# EAGLE design ir-control (EAGLE 7.6.0)
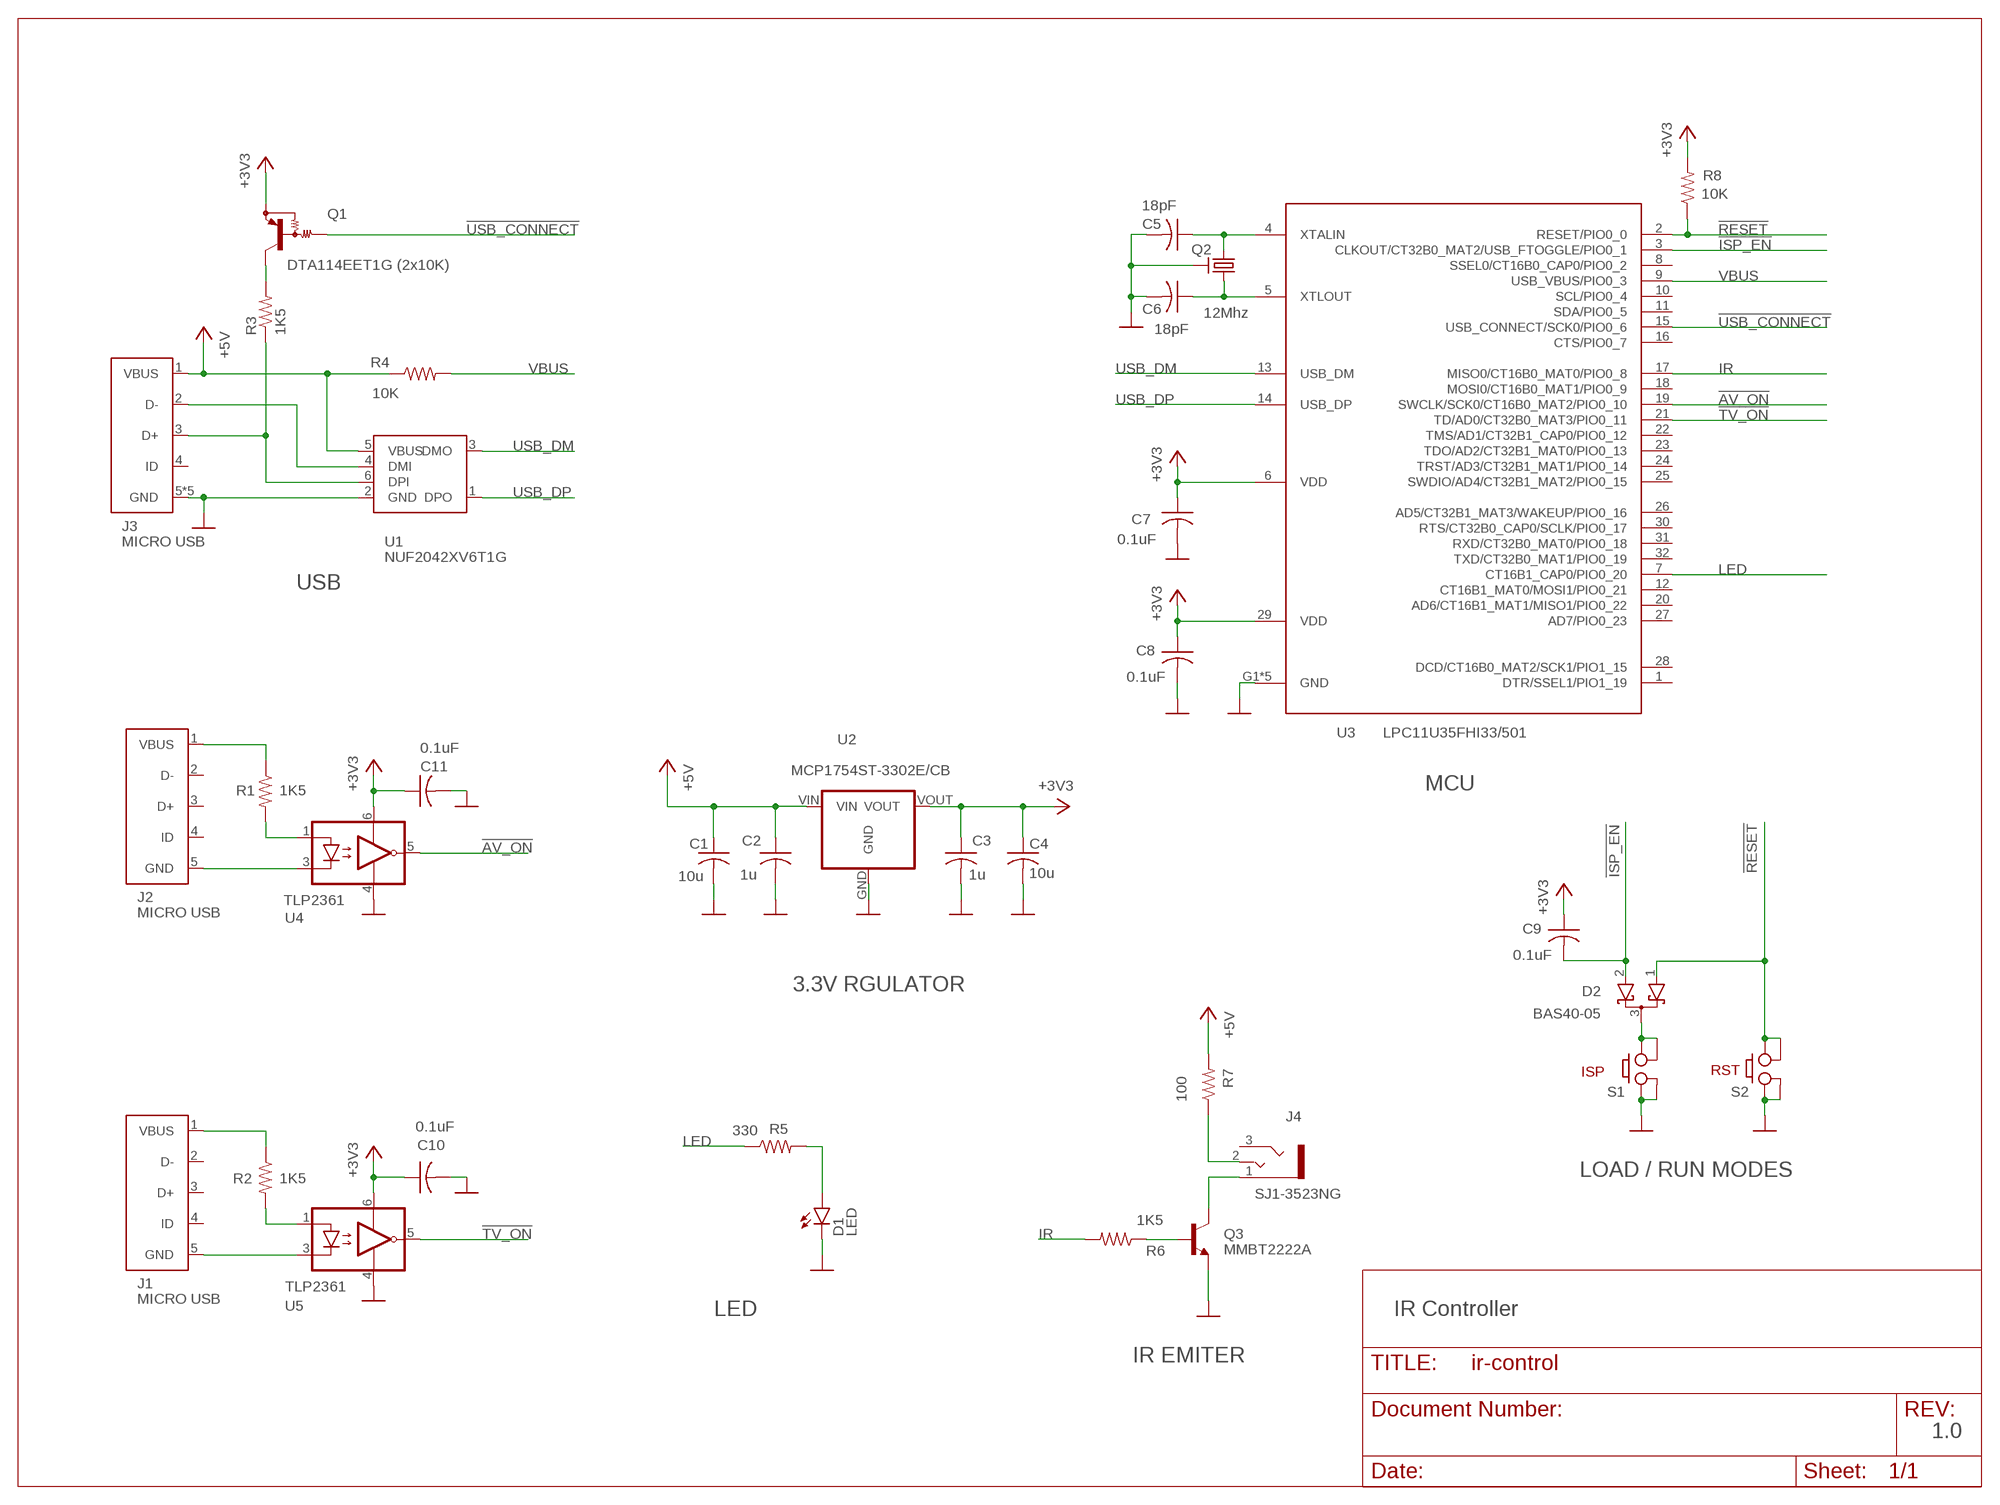
[diagram p0: schematic, sheet 1]

## Parts
C1  10u  CC0805K  [C0805K]
C2  1u  CC0603K  [C0603K]
C3  1u  CC0603K  [C0603K]
C4  10u  CC0805K  [C0805K]
C5  18pF  CC0402K  [C0402K]
C6  18pF  CC0402K  [C0402K]
C7  0.1uF  CC0402K  [C0402K]
C8  0.1uF  CC0402K  [C0402K]
C9  0.1uF  CC0402K  [C0402K]
C10  0.1uF  CC0402K  [C0402K]
C11  0.1uF  CC0402K  [C0402K]
D1  LED  [LED]
D2  BAS40-05  [SOT23]
J1  MICRO USB  USB-CONN-UNSHIELDED  [USB-MICRO]
J2  MICRO USB  USB-CONN-UNSHIELDED  [USB-MICRO]
J3  MICRO USB  USB-CONN  [USB-MICRO]
J4  SJ1-3523NG  JACKX  [JACK]
Q1  DTA114EET1G (2x10K)  PNP-BIASED  [SC75-BEC]
Q2  12Mhz  CRYSTALCTS406  [CRYSTAL]
Q3  MMBT2222A  NPN  [SOT23]
R1  1K5  RR0402  [R0402]
R2  1K5  RR0402  [R0402]
R3  1K5  RR0402  [R0402]
R4  10K  RR0402  [R0402]
R5  330  RR0402  [R0402]
R6  1K5  RR0402  [R0402]
R7  100  RR0402  [R0402]
R8  10K  RR0402  [R0402]
S1  CKN10502CT-ND  PUSH-BUTTON  [PUSH_BUTTON]
S2  PUSH-BUTTON  [PUSH_BUTTON]
U1  NUF2042XV6T1G  USB-ESD  [SOT-563]
U2  MCP1754ST-3302E/CB  LDO  [SOT-23A]
U3  LPC11U35FHI33/501  LPC11U35FHN33/501  [HVQFN33-5MM]
U4  TLP2361  OPTO_COUPLER  [SO6]
U5  TLP2361  OPTO_COUPLER  [SO6]

## Nets
!AV_ON: U3.19(SWCLK/SCK0/CT16B0_MAT2/PIO0_10) U4.5(OUT)
!ISP_EN: C9.2 D2.2(A2) U3.3(CLKOUT/CT32B0_MAT2/USB_FTOGGLE/PIO0_1)
!RESET: D2.1(A1) R8.1 S2.B1 S2.B1P(B1) S2.B2 S2.B2P(B2) U3.2(RESET/PIO0_0)
!TV_ON: U3.21(TD/AD0/CT32B0_MAT3/PIO0_11) U5.5(OUT)
!USB_CONNECT: Q1.B U3.15(USB_CONNECT/SCK0/PIO0_6)
+3V3: C3.1 C4.1 C7.1 C8.1 C9.1 C10.1 C11.1 Q1.E R8.2 U2.VOUT U3.6(VDD) U3.29(VDD) U4.6(VCC) U5.6(VCC)
+5V: C1.1 C2.1 J3.1(VBUS) R4.1 R7.2 U1.5(VBUS) U2.VIN
GND: C1.2 C2.2 C3.2 C4.2 C5.2 C6.2 C7.2 C8.2 C10.2 C11.2 D1.K(C) J3.5(GND) J3.G1(GND) J3.G2(GND) J3.G3(GND) J3.G4(GND) Q2.2(GND) Q2.4(GND) Q3.2(E) S1.A1 S1.A1P(A1) S1.A2 S1.A2P(A2) S2.A1 S2.A1P(A1) S2.A2 S2.A2P(A2) U1.2(GND) U2.GND U3.G1(GND) U3.G2(GND) U3.G3(GND) U3.G4(GND) U3.TAB(GND) U4.4(GND) U5.4(GND)
IR: R6.2 U3.17(MISO0/CT16B0_MAT0/PIO0_8)
LED: R5.1 U3.7(CT16B1_CAP0/PIO0_20)
N$1: C5.1 Q2.3 U3.4(XTALIN)
N$2: J2.1(VBUS) R1.1
N$3: C6.1 Q2.1 U3.5(XTLOUT)
N$4: Q3.1(B) R6.1
N$5: Q1.C R3.2
N$6: J3.3(D+) R3.1 U1.6(DPI)
N$7: J1.1(VBUS) R2.1
N$8: J4.1 Q3.3(C)
N$9: J4.2 R7.1
N$10: J2.5(GND) U4.3(C)
N$11: J1.5(GND) U5.3(C)
N$12 [critical]: J3.2(D-) U1.4(DMI)
N$13: R2.2 U5.1(A)
N$14: D1.A R5.2
N$15: R1.2 U4.1(A)
N$16: D2.3(C) S1.B1 S1.B1P(B1) S1.B2 S1.B2P(B2)
USB_DM [critical]: U1.3(DMO) U3.13(USB_DM)
USB_DP [critical]: U1.1(DPO) U3.14(USB_DP)
VBUS: R4.2 U3.9(USB_VBUS/PIO0_3)
Unconnected: J1.2(D-) J1.3(D+) J1.4(ID) J2.2(D-) J2.3(D+) J2.4(ID) J3.4(ID) J4.3 U3.1(DTR/SSEL1/PIO1_19) U3.8(SSEL0/CT16B0_CAP0/PIO0_2) U3.10(SCL/PIO0_4) U3.11(SDA/PIO0_5) U3.12(CT16B1_MAT0/MOSI1/PIO0_21) U3.16(CTS/PIO0_7) U3.18(MOSI0/CT16B0_MAT1/PIO0_9) U3.20(AD6/CT16B1_MAT1/MISO1/PIO0_22) U3.22(TMS/AD1/CT32B1_CAP0/PIO0_12) U3.23(TDO/AD2/CT32B1_MAT0/PIO0_13) U3.24(TRST/AD3/CT32B1_MAT1/PIO0_14) U3.25(SWDIO/AD4/CT32B1_MAT2/PIO0_15) U3.26(AD5/CT32B1_MAT3/WAKEUP/PIO0_16) U3.27(AD7/PIO0_23) U3.28(DCD/CT16B0_MAT2/SCK1/PIO1_15) U3.30(RTS/CT32B0_CAP0/SCLK/PIO0_17) U3.31(RXD/CT32B0_MAT0/PIO0_18) U3.32(TXD/CT32B0_MAT1/PIO0_19)

## Notes on the sheet
- USB
- MCU
- 3.3V RGULATOR
- ISP | RST
- LOAD / RUN MODES
- LED | IR Controller
- IR EMITER
- 1.0

## Library data of the parts
C1-C11 = ir-control:C
D1 = ir-control:LED
D2 = ir-control:BAS40-05
J1 J2 = ir-control:USB-CONN-UNSHIELDED
J3 = ir-control:USB-CONN
J4 = ir-control:JACK: Jack connectors according to JISC 6560, 2.5mm / 3.5 mm Klinkensteckverbinder nach JISC 6560, 2.5mm / 3,5 mm Source: http://www.lumberg.com/Produkte/PDFs/KLBR2.pdf www.lumberg.com/Produkte/PDFs/KLBR1.pdf; MPN: KLBR 1; OC_FARNELL: 1200140; OC_NEWARK: 97K2707
Q1 = ir-control:PNP-BIASED: DTA114EET1G (Digikey DTA114EET1GOSCT-ND)
Q2 = ir-control:CRYSTAL: CRYSTAL; OC_FARNELL: unknown; OC_NEWARK: unknown
Q3 = ir-control:NPN: NPN Transistor
R1-R8 = ir-control:R: RESISTOR, American symbol
S1 S2 = ir-control:PUSH-BUTTON: CKN10502CT-ND
U1 = ir-control:USB-ESD
U2 = ir-control:LDO
U3 = ir-control:LPC11U35FHN33/501
U4 U5 = ir-control:OPTO_COUPLER

## Net classes
0 default: clearance 0.205 mm
1 power: width 0.254 mm
2 critical: clearance 0.205 mm to class 0, clearance 0.205 mm to class 1, clearance 0.205 mm

## Board
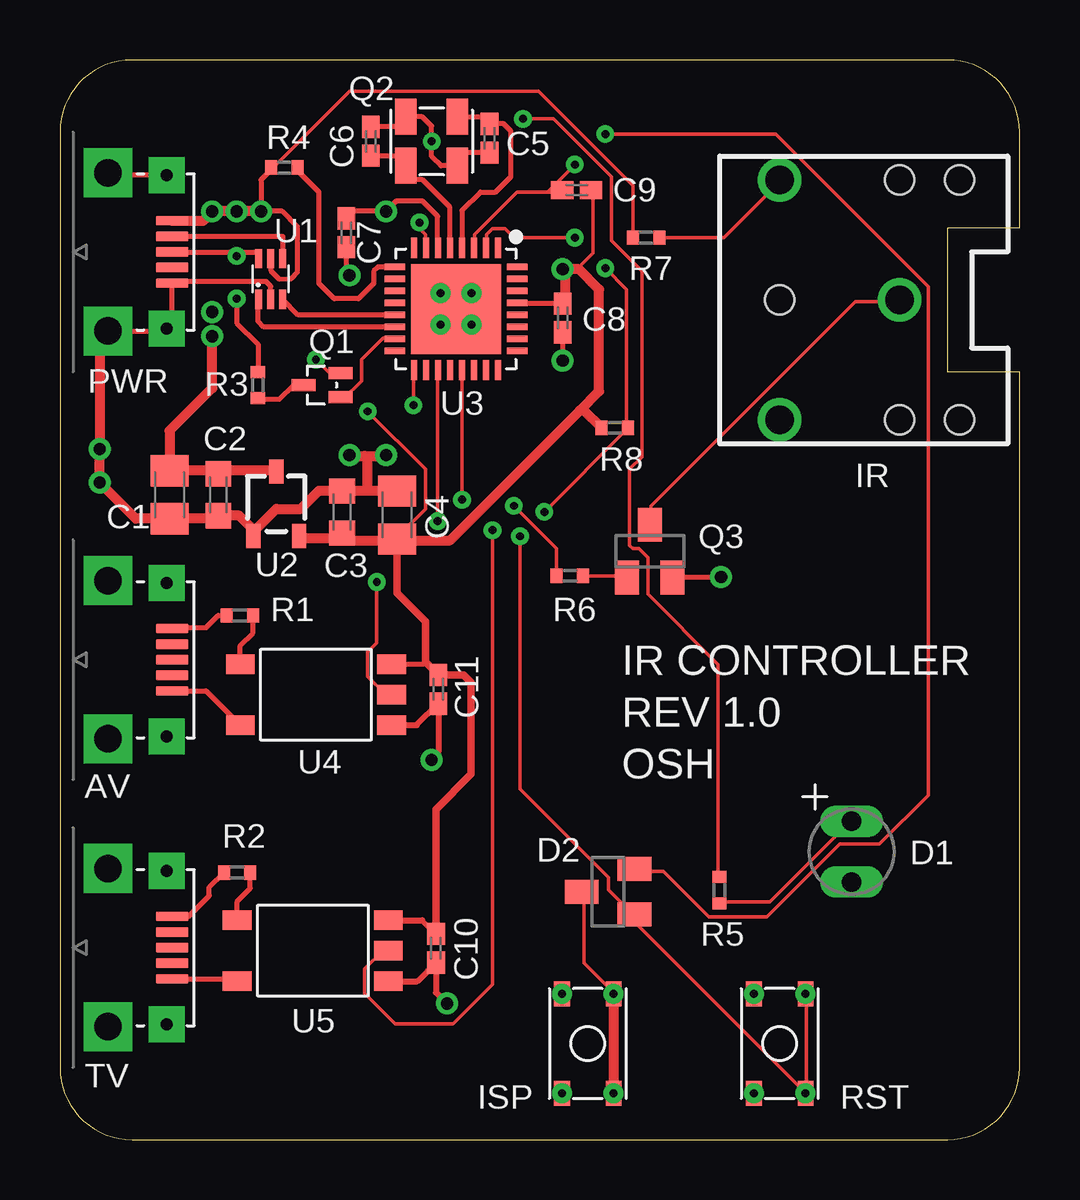
[diagram p1: board, top side]
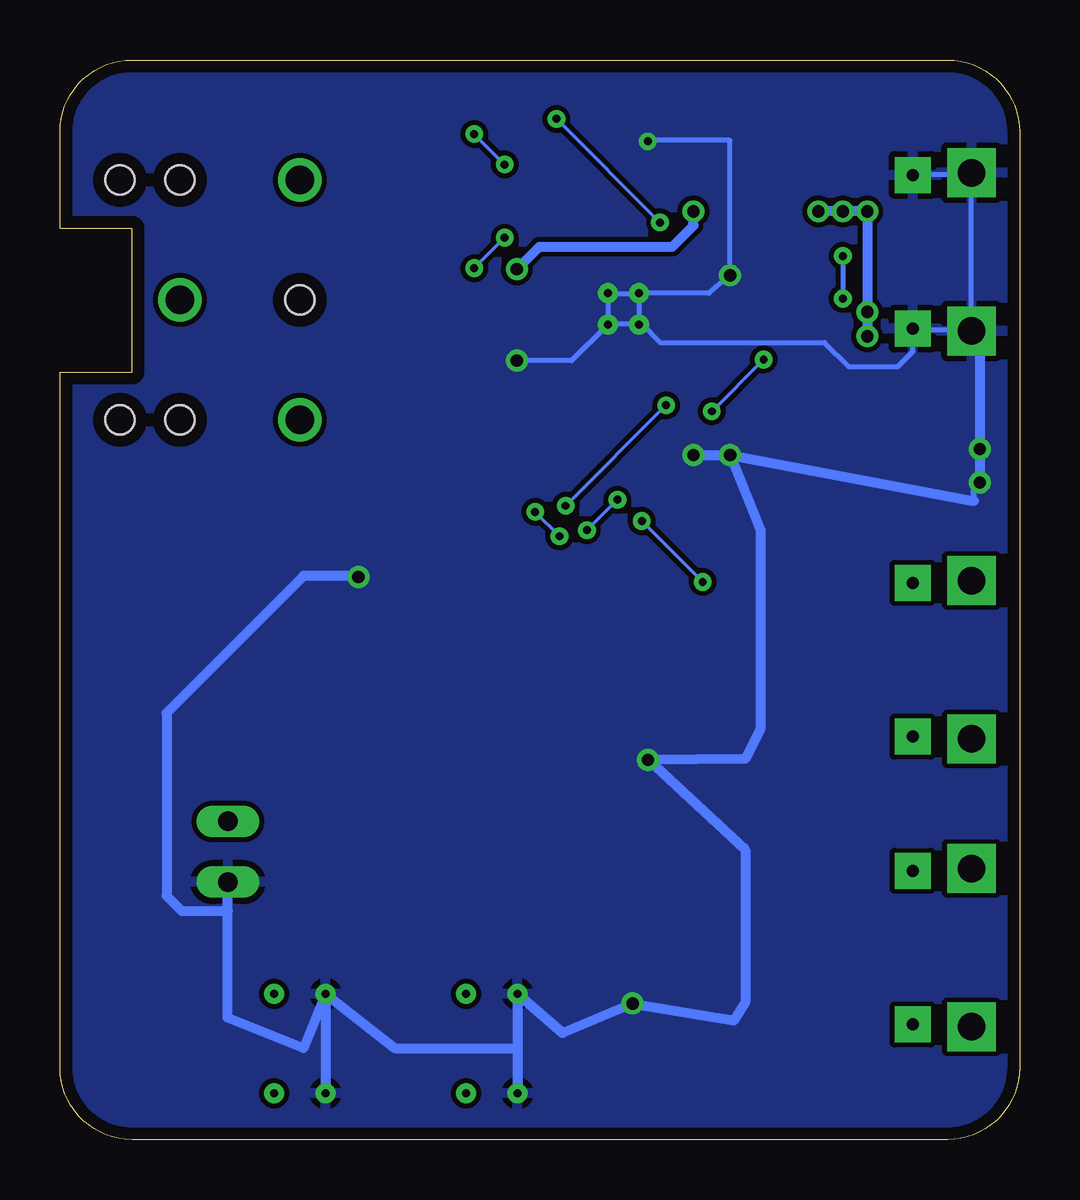
[diagram p2: board, bottom side, seen from below]

Size 40 x 45 mm. Coordinates in mm from the lower left corner, seen from the top.
Outline: 0,42 0,3 arc90 3,0 37,0 arc90 40,3 40,32 37,32 37,38 40,38 40,42 arc90 37,45 3,45 arc90 0,42
Copper layers (1*16): Top 0.035mm / dielectric 1.5mm / Bottom 0.035mm
Design rules "default *": minimum track width 6mil, minimum drill 13mil, track to track 6mil, track to pad 6mil, pad to pad 6mil, via to via 6mil, smd to smd 6mil, copper to edge 20mil, drill to drill 8mil, minimum pad ring 10mil, minimum via ring 8mil, stop-mask expansion 4mil, vias tented up to drill 20mil, thermal gap 10mil
tRestrict: area -0.4,33.3 to 0.8,41.1; area -0.4,16.1 to 0.8,24; area -0.4,4.1 to 0.8,11.9

### Footprints (pad centres in the part's own frame; a part is rotated, then mirrored left to right if it is on the bottom)
C0805K = smd 1.3 x 1.6: 1 -1,0; 2 1,0
C0603K = smd 1.05 x 1.08: 1 -0.875,0; 2 0.875,0
C0402K = smd 0.925 x 0.74: 1 -0.6,0; 2 0.6,0
LED = drill 0.813 long: A -1.27,0; K 1.27,0
SOT23 = smd 1 x 1.4: 1 -0.95,-1.1; 2 0.95,-1.1; 3 0,1.1
USB-MICRO = smd 0.4 x 1.35: 1 -1.3,2.675; 2 -0.65,2.675; 3 0,2.675; 4 0.65,2.675; 5 1.3,2.675 | drill 1.143 pad 2.032 square: G1 -3.3,0; G2 3.3,0 | drill 0.508 pad 1.5 square: G3 -3.2,2.45; G4 3.2,2.45
JACK = drill 1.2: 1 -5,0; 2 0,-5; 3 0,5 | hole 1.2: 0,0; -5,5; -7.5,5; -7.5,-5; -5,-5
SC75-BEC = smd 0.5 x 1: B -0.5,-0.771; C 0,0.771; E 0.5,-0.771
CRYSTAL = smd 0.9 x 1.5: 1 -1.075,-1.025; 2 1.075,-1.025; 3 1.075,1.025; 4 -1.075,1.025
R0402 = smd 0.5 x 0.6: 1 -0.55,0; 2 0.55,0
PUSH_BUTTON = smd 1.05 x 0.65: A1 -2.075,1.075; A2 2.075,1.075; B1 -2.075,-1.075; B2 2.075,-1.075 | drill 0.33 pad 0.61: A1P -2.075,1.075; A2P 2.075,1.075; B1P -2.075,-1.075; B2P 2.075,-1.075
SOT-563 = smd 0.3 x 0.8: 1 -0.5,-0.85; 2 0,-0.85; 3 0.5,-0.85; 4 0.5,0.85; 5 0,0.85; 6 -0.5,0.85
SOT-23A = smd 0.6 x 1: GND -0.95,-1.35; VIN 0,1.35; VOUT 0.95,-1.35
HVQFN33-5MM = smd 0.85 x 0.27: 1 -2.55,1.75; 2 -2.55,1.25; 3 -2.55,0.75; 4 -2.55,0.25; 5 -2.55,-0.25; 6 -2.55,-0.75; 7 -2.55,-1.25; 8 -2.55,-1.75; 17 2.55,-1.75; 18 2.55,-1.25; 19 2.55,-0.75; 20 2.55,-0.25; 21 2.55,0.25; 22 2.55,0.75; 23 2.55,1.25; 24 2.55,1.75 | smd 0.27 x 0.85: 9 -1.75,-2.55; 10 -1.25,-2.55; 11 -0.75,-2.55; 12 -0.25,-2.55; 13 0.25,-2.55; 14 0.75,-2.55; 15 1.25,-2.55; 16 1.75,-2.55; 25 1.75,2.55; 26 1.25,2.55; 27 0.75,2.55; 28 0.25,2.55; 29 -0.25,2.55; 30 -0.75,2.55; 31 -1.25,2.55; 32 -1.75,2.55 | drill 0.33 pad 0.6: G1 -0.65,0.65; G2 -0.65,-0.65; G3 0.65,-0.65; G4 0.65,0.65 | smd 3.75 x 3.75: TAB 0,0
SO6 = smd 0.8 x 1.2: 1 -1.27,-3.15; 3 1.27,-3.15; 4 1.27,3.15; 5 0,3.15; 6 -1.27,3.15

### Placement (x,y rotation side)
C1  4.57,26.88 270 top
C2  6.6,26.88 270 top
C3  11.76,26.16 90 top
C4  14.05,26.04 90 top
C5  17.91,41.74 270 top
C6  12.95,41.61 90 top
C7  11.94,37.8 270 top
C8  20.95,34.24 270 top
C9  21.53,39.57 180 top
C10  15.67,7.98 270 top
C11  15.77,18.77 270 top
D1  33,12 270 top
D2  22.85,10.33 90 top
J1  2,8 270 top
J2  2,20 270 top
J3  2,37 270 top
J4  30,35 180 top
Q1  10.92,31.45 90 top
Q2  15.49,41.61 0 top
Q3  24.59,24.53 0 top
R1  7.49,21.84 0 top
R2  7.38,11.13 0 top
R3  8.26,31.45 270 top
R4  9.35,40.51 0 top
R5  27.49,10.39 270 top
R6  21.26,23.5 180 top
R7  24.43,37.59 180 top
R8  23.12,29.67 180 top
S1  22,4 90 top
S2  30,4 90 top
U1  8.79,35.88 0 top
U2  9.02,26.5 0 top
U3  16.51,34.62 270 top
U4  10.67,18.54 270 top
U5  10.54,7.87 270 top

### Tracks (layer width: path | path; a pad name or v marks a point on that pad's centre or on a via)
!AV_ON  (via drill 0.33)
  Top 0.152: v15.75,25.78 15.75,32 U3.19 | v13.21,23.24 13.21,20.7 12.83,20.32 12.83,19.3 13.59,18.54 U4.5
  Bottom 0.152: v13.21,23.24 v15.75,25.78
!ISP_EN  (via drill 0.33)
  Top 0.152: 20.32,39.5 20.83,39.5 C9.2 | 20.32,39.5 19.05,39.5 17.27,37.72 17.27,37.21 U3.3 | v22.73,41.91 29.84,41.91 36.2,35.56 36.2,14.35 34.16,12.32 32.51,12.32 29.46,9.27 27.05,9.27 25.15,11.18 24,11.18 D2.2 | 20.32,39.5 v21.46,40.64
  Bottom 0.152: v21.46,40.64 v22.73,41.91
!RESET  (via drill 0.33)
  Top 0.152: v22.73,36.32 23.62,35.43 23.62,29.72 R8.1 23.62,29.59 v20.19,26.16 | v21.46,37.59 18.92,37.59 18.54,37.97 18.03,37.97 17.78,37.72 17.78,37.21 U3.2 | 31.11,6.1 S2.B2P 31.11,5.97 31.11,2.03 S2.B1P | 31.11,1.91 S2.B1P | S2.B1P 30.99,2.03 24,9.02 24,9.27 D2.1 23.88,9.4 22.86,10.41 22.86,10.92 19.18,14.61 v19.18,25.15
  Bottom 0.152: v21.46,37.59 v22.73,36.32 | v19.18,25.15 v20.19,26.16
!TV_ON  (via drill 0.33)
  Top 0.152: v16.76,26.67 16.76,32 U3.21 | v18.03,25.4 18.03,6.48 16.38,4.83 13.97,4.83 12.7,6.1 12.7,7.11 13.46,7.87 U5.5
  Bottom 0.152: v18.03,25.4 v16.76,26.67
!USB_CONNECT
  Top 0.152: U3.15 13.84,33.4 13.46,33.4 12.57,32.51 12.57,31.62 11.81,30.86 Q1.B
+3V3  (via drill 0.33, 0.51)
  Top 0.152: 22.1,39.5 C9.1 22.23,39.5 22.23,36.96 21.72,36.45 21.64,36.27 | Q1.E 11.68,32 11.18,32 v10.67,32.51 | 21.05,36.2 21.08,36.2 v20.95,36.27 | 14.1,24.97 14.1,25.02 C4.1 14.1,25.15 15.24,26.29 15.24,27.94 v12.83,30.35
  Top 0.203: U3.6 15.75,37.19 15.75,38.48 15.11,39.12 14.02,39.12 v13.59,38.69 12.23,38.69 C7.1 | U3.29 20.92,34.87 C8.1 | 15.24,19.9 15.15,19.81 U4.6 | 15.1,9.14 C10.1
  Top 0.254: U5.6 15.1,9.14
  Top 0.305: C10.1 15.67,13.77 17.14,15.24 17.14,19.05 16.82,19.37 C11.1 15.24,19.9 15.24,21.59 14.05,22.78 C4.1
  Top 0.406: U2.VOUT 9.89,25.07 11.55,25.07 C3.1 12.08,24.97 14.1,24.97 16.26,24.97 21.68,30.39 | 21.68,30.39 22.48,31.2 22.48,35.43 21.64,36.27 v20.95,36.27 | 21.05,36.24 21.05,36.2 21.05,34.94 C8.1 | R8.2 21.85,30.39 21.68,30.39
  Bottom 0.152: 21.08,36.2 v20.95,36.27 | v12.83,30.35 v10.67,32.51
  Bottom 0.406: v13.59,38.69 13.59,38.1 14.48,37.21 20.02,37.21 v20.95,36.27
+5V  (via drill 0.51)
  Top 0.152: R7.2 23.88,39.75 19.94,43.69 12.06,43.69 8.89,40.51 R4.1
  Top 0.203: U1.5 8.79,36.23 9.14,35.87 9.65,35.89 9.91,36.15 9.91,38.05 9.27,38.69 v8.38,38.69 8.38,40.01 8.8,40.42 R4.1
  Top 0.406: v6.35,33.48 6.35,31.32 4.57,29.54 C1.1 6.48,27.88 | U2.VIN 8.97,27.89 8.95,27.88 6.48,27.88 | J3.1 5.96,38.3 v6.35,38.69 v7.37,38.69 | v8.38,38.69 7.41,38.69 7.37,38.73 | C2.1 6.48,27.88
  Bottom 0.406: v8.38,38.69 v6.35,38.69 v6.35,34.5 v6.35,33.48 6.35,33.35
GND  (via drill 0.33, 0.51)
  Top 0.203: J3.G2 4.45,33.7 J3.G4 4.67,33.8 J3.5 4.74,35.77 8.59,35.77 8.79,35.57 U1.2 | J3.G3 2,40.2 J3.G1 | C5.2 16.29,41.14 16.26,41.1 16.26,40.9 Q2.2 15.88,40.58 15.49,40.97 v15.49,41.61 15.49,42.24 15.1,42.63 Q2.4 14.42,42.57 14.1,42.24 12.99,42.24 C6.2 | U3.TAB U3.G4 | U3.TAB U3.G3 | U3.G2 U3.TAB | U3.G1 U3.TAB | C8.2 v20.95,32.47 | v12.06,36.02 11.94,36.15 C7.2 | Q3.2 25.56,23.45 v27.56,23.45 | 12.8,28.47 12.75,28.53 12.7,28.53 12.7,28.5 | 13.59,28.5 v13.59,28.53
  Top 0.254: C1.2 4.57,25.91 | 8.13,25.35 8.13,25.15 U2.GND | v15.49,15.83 15.77,16.18 C11.2 14.88,17.27 U4.4 | v16.13,5.67 15.67,6.12 C10.2 14.9,6.6 U5.4
  Top 0.406: J3.G2 1.65,33.35 v1.65,28.78 v1.65,27.39 3.16,25.88 C1.2 6.48,25.88 C2.2 7.48,26 8.13,25.35 8.13,25.4 9.02,26.29 10.03,26.29 10.79,27.05 C3.2 | 11.56,27.24 C3.2 | C4.2 C3.2 | 12.8,28.47 12.8,27.05 | 12.06,28.5 12.7,28.5 13.59,28.5
  Bottom 0.152: 15.49,41.66 v15.49,41.61 | 12.06,36.07 v12.06,36.02 | 17.25,33.89 17.27,33.91 U3.G4 | v15.49,15.83 15.49,15.88 15.47,15.82 | 27.56,23.5 v27.56,23.45 | 33.15,9.53 33,9.52 | 16.1,5.64 16.13,5.46 v16.13,5.67 | U3.G3 15.75,34.04 15.75,33.99 | J3.G1 2.03,40.26 2.03,40.21
  Bottom 0.203: 2.03,33.73 2.03,40.21 4.45,40.21 4.45,40.09 | 2.03,33.73 2.03,33.61 | 2.03,33.73 4.45,33.73 | 4.45,33.73 4.57,33.73 | 15.75,33.99 14.99,33.23 8.13,33.23 7.11,32.21 5.08,32.21 4.45,32.85 4.45,33.73 | v12.06,36.02 12.94,35.27 U3.G2 | 17.14,33.99 15.88,33.99 15.88,35.26 17.14,35.26 17.14,34.12 17.27,33.99 17.14,33.99 | 17.14,33.99 U3.G4 17.25,33.89 18.67,32.47 v20.95,32.47 | 12.06,36.07 12.06,41.66 15.49,41.66 | v12.06,28.53 12.06,28.57
  Bottom 0.254: 1.91,26.62 1.91,27.39 v1.65,27.39
  Bottom 0.406: 2.03,33.73 1.65,33.73 v1.65,27.39 1.65,27.26 1.78,27.26 | v13.59,28.53 v12.06,28.53 1.91,26.62 | 20.93,3.81 S1.A2P 19.05,4.45 v16.13,5.67 | 20.93,3.81 S1.A1P | S2.A2P S2.A1P | S2.A2P 26.04,3.81 20.93,3.81 | S2.A2P 29.84,3.81 33.02,5.08 33,9.52 D1.K | 12.06,28.57 10.79,25.4 10.79,17.14 11.43,15.88 15.47,15.82 11.43,12.06 11.43,5.71 11.91,4.95 16.1,5.64 | 27.3,23.5 27.56,23.5 29.84,23.5 35.56,17.78 35.56,10.16 34.92,9.53 33.15,9.53 33.02,9.53
  pour Bottom: 0,0 40,0 40,45 0,45
IR  (via drill 0.33)
  Top 0.152: v18.92,26.42 20.7,24.64 R6.2 | v14.73,30.61 14.73,32 U3.17
  Bottom 0.152: v14.73,30.61 v18.92,26.42
LED  (via drill 0.33)
  Top 0.152: v19.3,42.55 20.57,42.55 22.99,40.13 22.99,37.47 24.26,36.2 24.26,28.45 23.75,27.94 23.75,24.77 23.88,24.64 24.13,24.64 24.51,24.26 24.51,22.73 27.43,19.81 27.43,11.05 R5.1 | v14.99,38.23 14.99,37.97 15.24,37.72 15.24,37.21 U3.7
  Bottom 0.152: v14.99,38.23 v19.3,42.55
N$1
  Top 0.203: Q2.3 17.61,42.63 C5.1 | C5.1 18,42.24 | U3.4 16.76,38.73 17.53,39.5 18.16,39.5 18.8,40.13 18.8,42.04 18.5,42.34 C5.1
N$2
  Top 0.203: J2.1 4.71,21.34 6.1,21.34 6.6,21.84 R1.1
N$3
  Top 0.203: 14.35,40.52 Q2.1 | C6.1 13.99,41.01 Q2.1 | U3.5 16.26,38.86 15.11,40.01 14.48,40.01 14.48,40.52 Q2.1
N$4
  Top 0.152: R6.1 23.62,23.5 Q3.1
N$5
  Top 0.203: R3.2 8.29,30.86 9.14,30.86 9.73,31.45 Q1.C
N$6  (via drill 0.33)
  Top 0.203: J3.3 7.11,37 | 7.11,37 8.29,37 U1.6 | v7.37,35.05 7.37,34.04 8.26,33.15 R3.1 | v7.37,36.83 7.11,36.83 7.11,37
  Bottom 0.203: v7.37,36.83 v7.37,35.05
N$7
  Top 0.203: J1.1 5.36,9.3 6.22,10.16 6.22,10.52 R2.1
N$8
  Top 0.152: Q3.3 24.64,25.65 24.64,26.42 33.15,34.92 34.92,34.92 J4.1
N$9
  Top 0.152: R7.1 27.69,37.59 29.97,39.88 J4.2
N$10
  Top 0.152: 4.57,18.67 J2.5
  Top 0.203: J2.5 6.09,18.7 U4.3
N$11
  Top 0.152: 4.57,6.6 J1.5
  Top 0.203: J1.5 7.29,6.7 U5.3
N$12
  Top 0.203: J3.2 9.29,37.65 U1.4
N$13
  Top 0.203: U5.1 7.39,9.93 7.93,10.47 R2.2
N$14
  Top 0.152: R5.2 27.56,9.91 29.59,9.91 32.89,13.21 D1.A
N$15
  Top 0.203: U4.1 7.52,20.6 8.04,21.12 R1.2
N$16
  Top 0.152: D2.3 21.84,10.29 21.84,7.37 22.99,6.22 S1.B2P
  Top 0.406: S1.B2P S1.B1P
USB_DM
  Top 0.203: U3.13 9.94,34.37 U1.3
USB_DP
  Top 0.203: U3.14 8.5,33.87 8.26,34.12 8.26,34.99 U1.1
VBUS
  Top 0.203: U3.9 13.26,36.37 13.08,36.2 13.08,35.69 12.45,35.05 11.43,35.05 10.79,35.69 10.79,39.5 9.9,40.39 R4.2

### Text on the board
tPlace: PWR | IR | IR CONTROLLER | REV 1.0 | OSH | AV | TV | ISP | RST